# EAGLE schematic prefab (EAGLE 7.4.0)
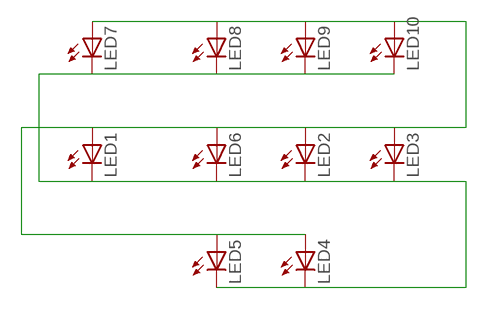
[diagram p0: schematic, sheet 1]

## Parts
LED1  LED1206  [LED-1206]
LED2  LED1206  [LED-1206]
LED3  LED1206  [LED-1206]
LED4  LED1206  [LED-1206]
LED5  LED1206  [LED-1206]
LED6  LED1206  [LED-1206]
LED7  LED1206  [LED-1206]
LED8  LED1206  [LED-1206]
LED9  LED1206  [LED-1206]
LED10  LED1206  [LED-1206]

## Nets
N$1: LED1.A LED2.A LED3.A LED4.A LED5.A LED6.A LED7.A LED8.A LED9.A LED10.A
N$2: LED1.C LED2.C LED3.C LED4.C LED5.C LED6.C LED7.C LED8.C LED9.C LED10.C

## Library data of the parts
LED1-LED10 = LilyPad-Wearables:LED: LEDs Standard schematic elements and footprints for 5mm, 3mm, 1206, and 0603 sized LEDs. 5mm - Spark Fun Electronics SKU : Comp-SBL